# EAGLE design SulaMatikV2 (EAGLE 6.4)
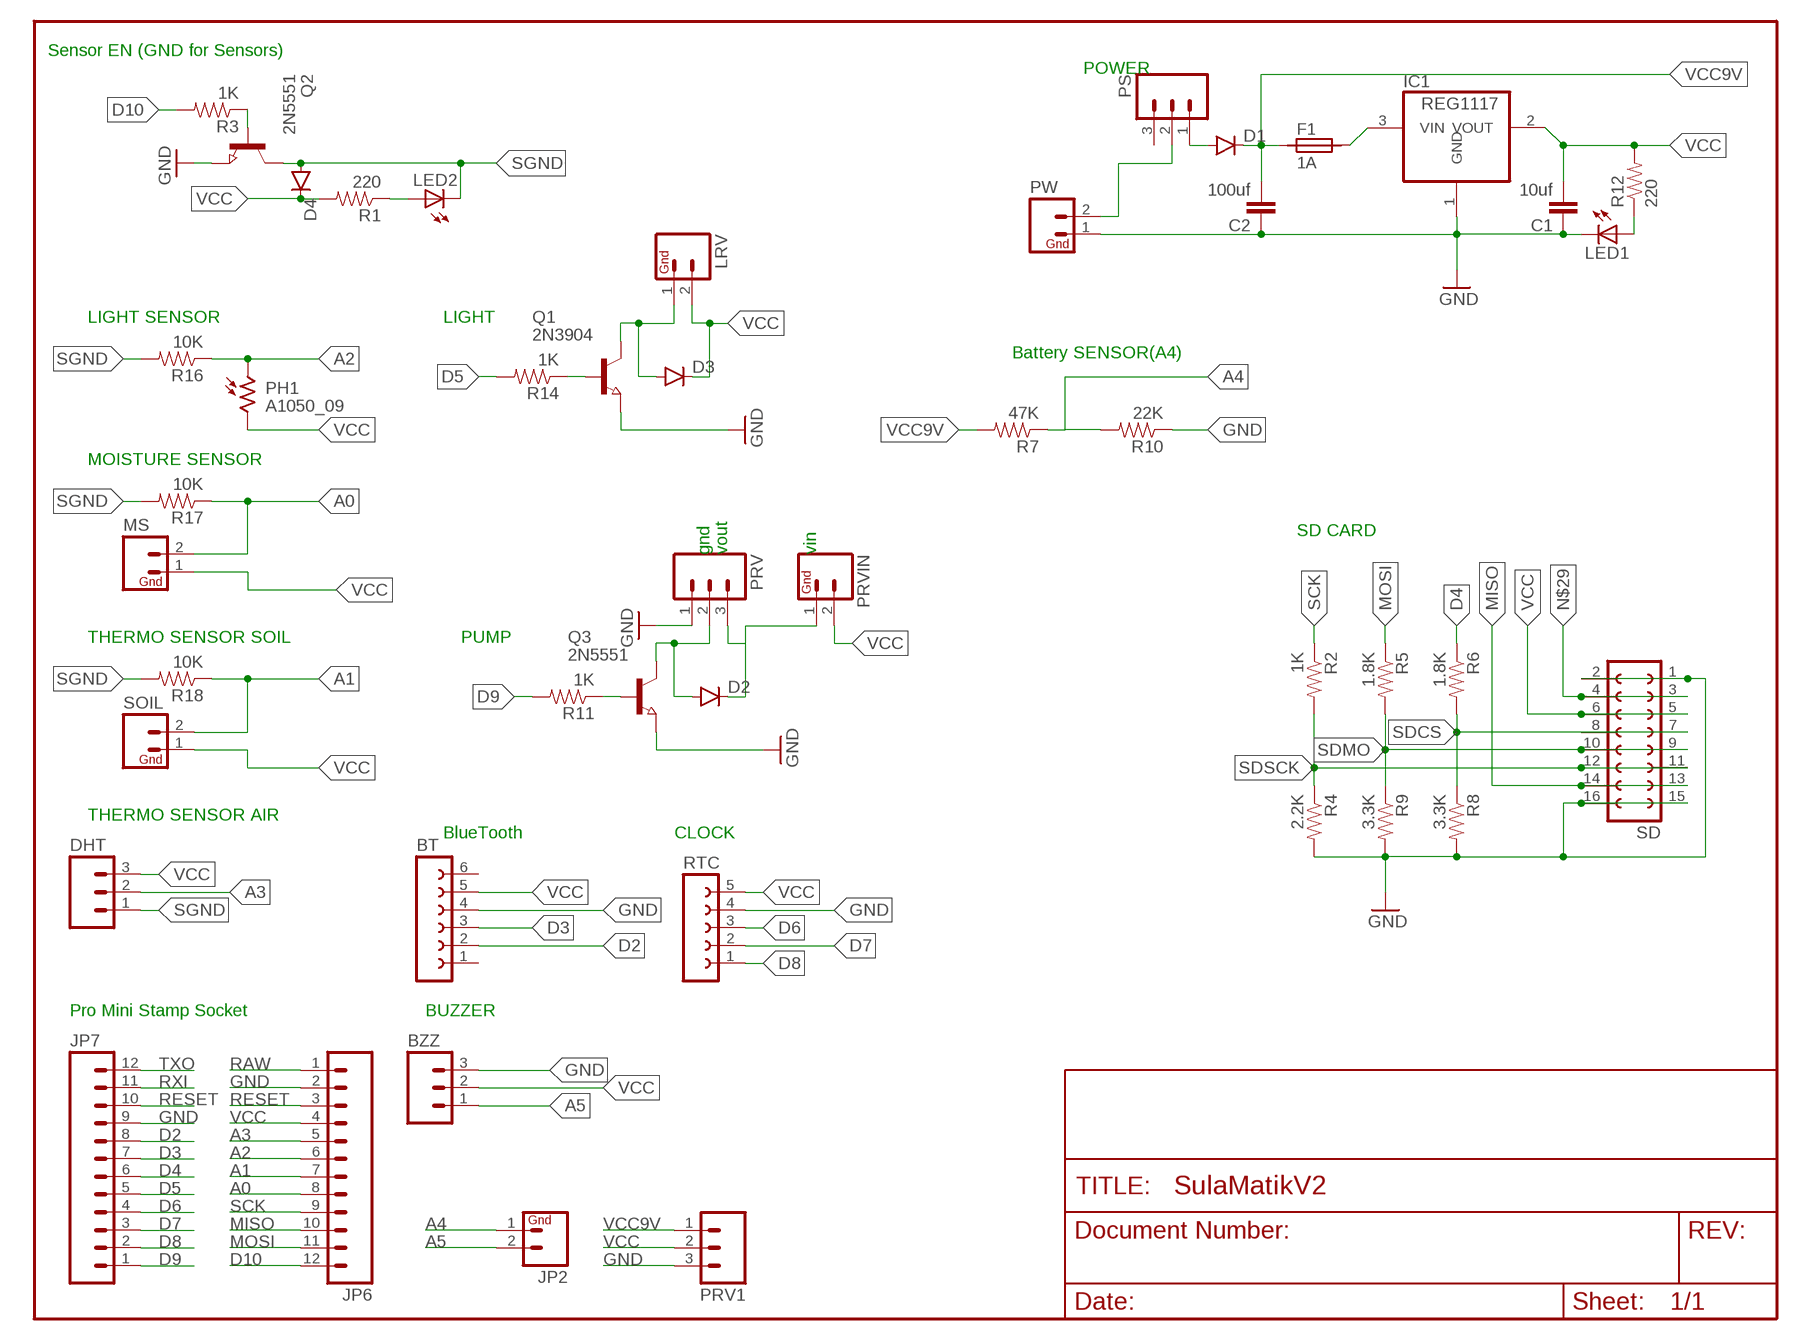
[diagram p0: schematic, sheet 1]

## Parts
BT  FE06-1  [FE06]
BZZ  M03PTH  [1X03]
C1  10uf  CAP0805  [0805]
C2  100uf  CAP0805  [0805]
D1  DIODESMA  [SMA-DIODE]
D2  DIODESMA  [SMA-DIODE]
D3  DIODESMA  [SMA-DIODE]
D4  DIODESMA  [SMA-DIODE]
DHT  M03PTH  [1X03]
F1  1A  SIBA194600  [1820]
IC1  REG1117  [SOT223]
JP2  M02PTH  [1X02]
JP6  M12PTH  [1X12]
JP7  M12PTH  [1X12]
LED1  LEDCHIP-LED0805  [CHIP-LED0805]
LED2  LEDCHIP-LED0805  [CHIP-LED0805]
LRV  M02PTH  [1X02]
MS  M02PTH  [1X02]
PH1  A1050_09  [T0-46-A10XX]
PRV  M03PTH  [1X03]
PRV1  M03PTH  [1X03]
PRVIN  M02PTH  [1X02]
PS  M03PTH  [1X03]
PW  M02PTH  [1X02]
Q1  2N3904  NPN-TRANSISTOR_SOT23  [SOT23]
Q2  2N5551  NPN-TRANSISTOR_SOT23  [SOT23]
Q3  2N5551  NPN-TRANSISTOR_SOT23  [SOT23]
R1  220  RESISTOR0805-RES  [0805]
R2  1K  RESISTOR0805-RES  [0805]
R3  1K  RESISTOR0805-RES  [0805]
R4  2.2K  RESISTOR0805-RES  [0805]
R5  1.8K  RESISTOR0805-RES  [0805]
R6  1.8K  RESISTOR0805-RES  [0805]
R7  47K  RESISTOR0805-RES  [0805]
R8  3.3K  RESISTOR0805-RES  [0805]
R9  3.3K  RESISTOR0805-RES  [0805]
R10  22K  RESISTOR0805-RES  [0805]
R11  1K  RESISTOR0805-RES  [0805]
R12  220  RESISTOR0805-RES  [0805]
R14  1K  RESISTOR0805-RES  [0805]
R16  10K  RESISTOR0805-RES  [0805]
R17  10K  RESISTOR0805-RES  [0805]
R18  10K  RESISTOR0805-RES  [0805]
RTC  FE05-1  [FE05-1]
SD  FE08-2  [FE08-2]
SOIL  M02PTH  [1X02]

## Nets
A0: JP6.8 MS.2 R17.1
A1: JP6.7 R18.1 SOIL.2
A2: JP6.6 PH1.1 R16.1
A3: DHT.2 JP6.5
A4: JP2.1 R7.1 R10.2
A5: BZZ.1 JP2.2
D2: BT.2 JP7.8
D3: BT.3 JP7.7
D4: JP7.6 R6.1
D5: JP7.5 R14.2
D6: JP7.4 RTC.3
D7: JP7.3 RTC.2
D8: JP7.2 RTC.1
D9: JP7.1 R11.2
D10: JP6.12 R3.2
GND: BT.4 BZZ.3 C1.1 C2.1 IC1.1(GND) JP6.2 JP7.9 LED1.C PRV1.3 PRV.1 PW.1 Q1.2(E) Q2.2(E) Q3.2(E) R4.2 R8.2 R9.2 R10.1 RTC.4 SD.1 SD.2 SD.15 SD.16
MISO: JP6.10 SD.13 SD.14
MOSI: JP6.11 R5.1
N$1: F1.2 IC1.3(VIN)
N$2: PS.2 PW.2
N$3: D2.C PRV.3 PRVIN.1
N$5: D2.A PRV.2 Q3.3(C)
N$6: Q3.1(B) R11.1
N$7: Q2.1(B) R3.1
N$11: LED1.A R12.1
N$13: D1.A PS.1
N$19: D3.A LRV.1 Q1.3(C)
N$20: Q1.1(B) R14.1
N$22: LED2.A R1.1
N$29: SD.3 SD.4
RAW [v]: JP6.1
RESET: JP6.3 JP7.10
RXI: JP7.11
SCK: JP6.9 R2.1
SDCS: R6.2 R8.1 SD.7 SD.8
SDMO: R5.2 R9.1 SD.9 SD.10
SDSCK: R2.2 R4.1 SD.11 SD.12
SGND: D4.A DHT.1 LED2.C Q2.3(C) R16.2 R17.2 R18.2
TXO: JP7.12
VCC: BT.5 BZZ.2 C1.2 D3.C D4.C DHT.3 IC1.2(VOUT) JP6.4 LRV.2 MS.1 PH1.2 PRV1.2 PRVIN.2 R1.2 R12.2 RTC.5 SD.5 SD.6 SOIL.1
VCC9V: C2.2 D1.C F1.1 PRV1.1 R7.2
Unconnected: BT.1 BT.6 PS.3

## Notes on the sheet
- Sensor EN (GND for Sensors)
- POWER
- LIGHT SENSOR | LIGHT
- Battery SENSOR(A4)
- MOISTURE SENSOR
- SD CARD
- gnd | vout | vin
- THERMO SENSOR SOIL | PUMP
- THERMO SENSOR AIR
- BlueTooth | CLOCK
- Pro Mini Stamp Socket | BUZZER

## Library data of the parts
BT = con-lsta:FE06-1: FEMALE HEADER; OC_FARNELL: unknown; OC_NEWARK: unknown
BZZ DHT PRV PRV1 PS = SparkFun-Connectors:M03: Header 3 Standard 3-pin 0.1" header. Use with straight break away headers (SKU : PRT-00116), right angle break away headers (PRT-00553), swiss pins (PRT-00743), machine pins (PRT-00117), and female headers (PRT-00115). Molex polarized connector foot print use with SKU : PRT-08232 with associated crimp pins and housings.
C1 C2 = SparkFun-Capacitors:CAP: Capacitor Standard 0603 ceramic capacitor, and 0.1" leaded capacitor.
D1-D4 = SparkFun-DiscreteSemi:DIODE: Diode These are standard reverse protection diodes and small signal diodes. SMA package can handle up to about 1A. SOD-323 can handle about 200mA. What the SOD-323 package when ordering, there are some mfgs out there that are 5-pin packages.
F1 = _hhn_PtcFuses_Siba_r500_Ozan:SIBA194600*: SIBA PTC-Fuses, Series 194600, 1812 (4.5 3.2)mm Source: www.siba.de/ Package: SMD 1812 (4.5 x 3.2)mm Technologies: SIBA194600Axxx xxx: Trip-Current * 10 mA Author: Dipl.-Ing. FH Rainer Bayer
IC1 = burr-brown:REG1117: 800mA and 1A Low Dropout (LDO) Positive Regulator 1.8V, 2.5V, 2.85V, 3.3V, 5V, and Adj; MPN: REG1117; OC_FARNELL: 1097566; OC_NEWARK: 14P6981
JP2 LRV MS PRVIN PW SOIL = SparkFun:M02: Header 2 Standard 2-pin 0.1" header. Use with straight break away headers (SKU : PRT-00116), right angle break away headers (PRT-00553), swiss pins (PRT-00743), machine pins (PRT-00117), and female headers (PRT-00115). Molex polarized connector foot print use with SKU : PRT-08233 with associated crimp pins and housings.
JP6 JP7 = SparkFun:M12: Header 12 Standard 12-pin 0.1" header. Use with straight break away headers (SKU : PRT-00116), right angle break away headers (PRT-00553), swiss pins (PRT-00743), machine pins (PRT-00117), and female headers (PRT-00115).
LED1 LED2 = led:LED: LED OSRAM: - CHIPLED LG R971, LG N971, LY N971, LG Q971, LY Q971, LO R971, LY R971 LH N974, LH R974 LS Q976, LO Q976, LY Q976 LO Q996 - Hyper CHIPLED LW Q18S LB Q993, LB Q99A, LB R99A - SideLED LS A670, LO A670, LY A670, LG A670, LP A670 LB A673, LV A673, LT A673, LW A673 LH A674 LY A675 LS A676, LA A676, LO A676, LY A676, LW A676 LS A679, LY A679, LG A679 - Hyper Micro SIDELED® LS Y876, LA Y876, LO Y876, LY Y876 LT Y87S - SmartLED LW L88C, LW L88S LB L89C, LB L89S, LG L890 LS L89K, LO L89K, LY L89K LS L896, LA L896, LO L896, LY L896 - TOPLED LS T670, LO T670, LY T670, LG T670, LP T670 LSG T670, LSP T670, LSY T670, LOP T670, LYG T670 LG T671, LOG T671, LSG T671 LB T673, LV T673, LT T673, LW T673 LH T674 LS T676, LA T676, LO T676, LY T676, LB T676, LH T676, LSB T676, LW T676 LB T67C, LV T67C, LT T67C, LS T67K, LO T67K, LY T67K, LW E67C LS E67B, LA E67B, LO E67B, LY E67B, LB E67C, LV E67C, LT E67C LW T67C LS T679, LY T679, LG T679 LS T770, LO T770, LY T770, LG T770, LP T770 LB T773, LV T773, LT T773, LW T773 LH T774 LS E675, LA E675, LY E675, LS T675 LS T776, LA T776, LO T776, LY T776, LB T776 LHGB T686 LT T68C, LB T68C - Hyper Mini TOPLED® LB M676 - Mini TOPLED Santana® LG M470 LS M47K, LO M47K, LY M47K Source: http://www.osram.convergy.de LUXEON: - LUMILED® LXK2-PW12-R00, LXK2-PW12-S00, LXK2-PW14-U00, LXK2-PW14-V00 LXK2-PM12-R00, LXK2-PM12-S00, LXK2-PM14-U00 LXK2-PE12-Q00, LXK2-PE12-R00, LXK2-PE12-S00, LXK2-PE14-T00, LXK2-PE14-U00 LXK2-PB12-K00, LXK2-PB12-L00, LXK2-PB12-M00, LXK2-PB14-N00, LXK2-PB14-P00, LXK2-PB14-Q00 LXK2-PR12-L00, LXK2-PR12-M00, LXK2-PR14-Q00, LXK2-PR14-R00 LXK2-PD12-Q00, LXK2-PD12-R00, LXK2-PD12-S00 LXK2-PH12-R00, LXK2-PH12-S00 LXK2-PL12-P00, LXK2-PL12-Q00, LXK2-PL12-R00 Source: www.luxeon.com KINGBRIGHT: KA-3528ASYC Source: www.kingbright.com
PH1 = photo-elements:A10: Sensor Robust Light Sensing Applications Outdoor Light Sensing Application Source: http://optoelectronics.perkinelmer.com/content/Datasheets/DTS_PhotocellsA1050.pdf
Q1-Q3 = semicon-smd-ipc:NPN-TRANSISTOR_: NPN TRANSISTOR
R1-R12 R14 R16-R18 = SparkFun-Passives:RESISTOR: Resistor Basic schematic elements and footprints for 0603, 1206, and PTH resistors.
RTC = con-lsta:FE05-1: FEMALE HEADER; OC_FARNELL: unknown; OC_NEWARK: unknown
SD = con-lsta:FE08-2: FEMALE HEADER; OC_FARNELL: unknown; OC_NEWARK: unknown

## Net classes
0 default: width 0.3 mm, drill 0.5 mm, clearance 0.25 mm

## Board
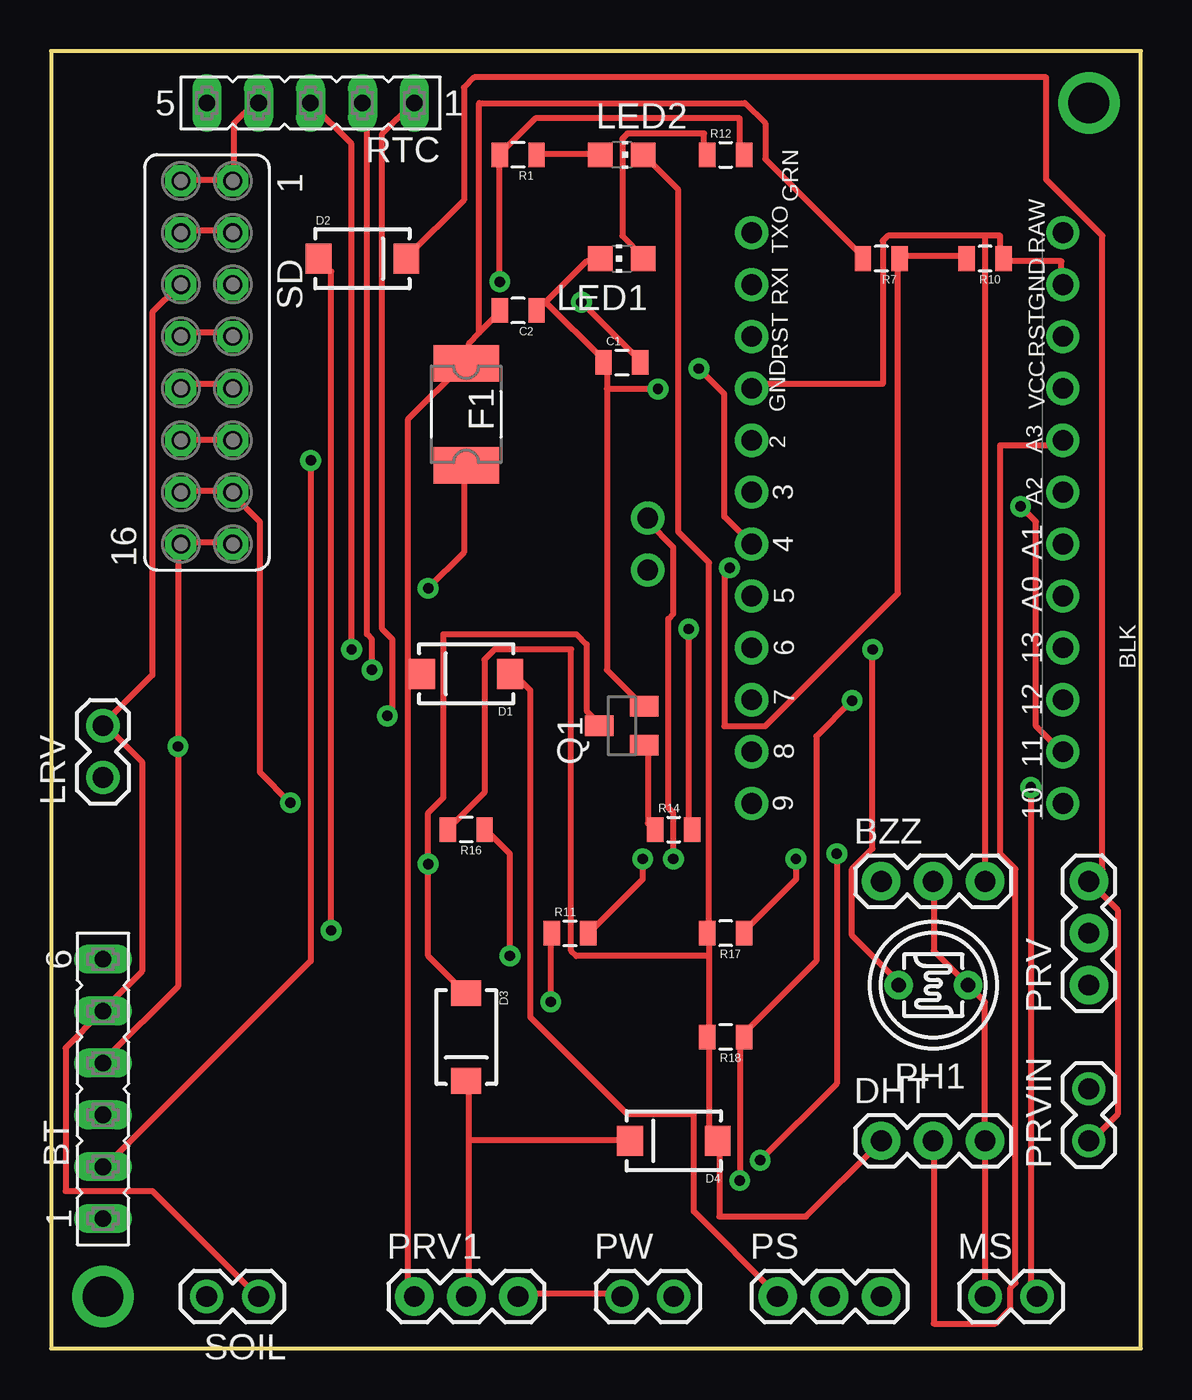
[diagram p1: board, top side]
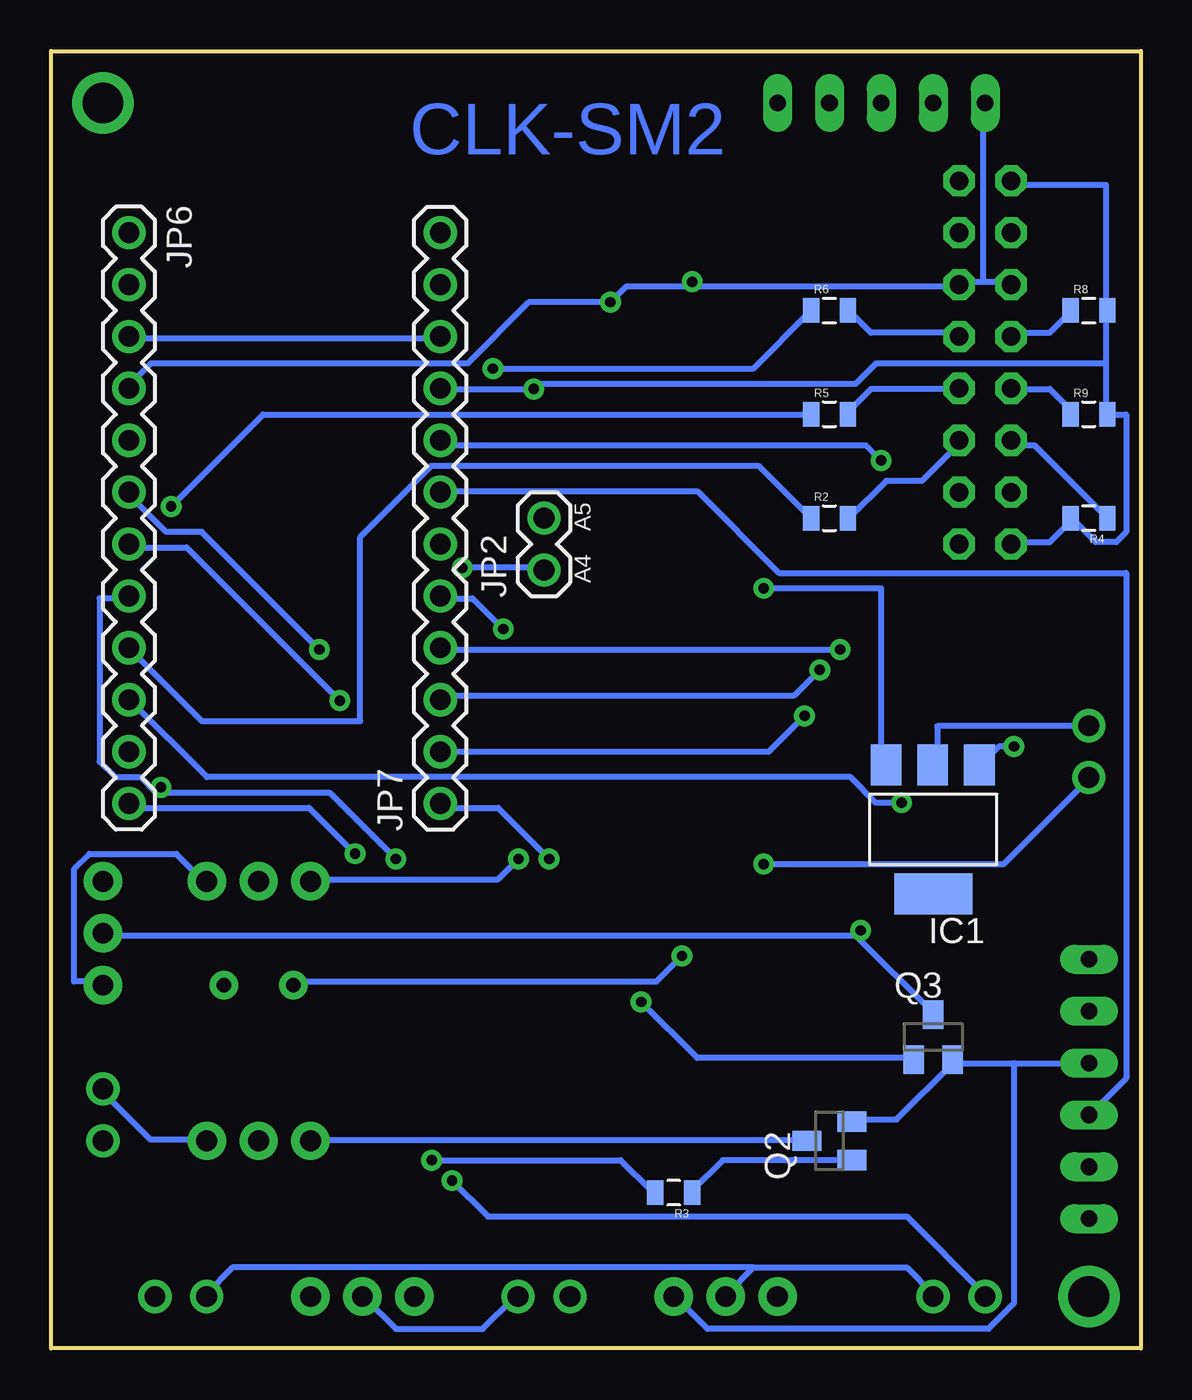
[diagram p2: board, bottom side, seen from below]

Size 53.34 x 63.5 mm. Coordinates in mm from the lower left corner, seen from the top.
Outline: 0,63.5 0,0 53.34,0 53.34,63.5 0,63.5
Copper layers (1*16): Top 0.035mm / dielectric 1.5mm / Bottom 0.035mm
Design rules "SparkFun *": minimum track width 8mil, minimum drill 20mil, track to track 8mil, track to pad 8mil, pad to pad 8mil, via to via 8mil, smd to smd 8mil, copper to edge 10mil, drill to drill 8mil, minimum pad ring 12mil, minimum via ring 10mil, stop-mask expansion 4mil, vias tented up to drill 20mil, thermal gap 10mil

### Footprints (pad centres in the part's own frame; a part is rotated, then mirrored left to right if it is on the bottom)
FE06 = drill 0.813 long: 1 -6.35,0; 2 -3.81,0; 3 -1.27,0; 4 1.27,0; 5 3.81,0; 6 6.35,0
1X03 = drill 1.016 pad 1.88: 1 0,0; 2 2.54,0; 3 5.08,0
0805 = smd 0.8 x 1.2: 1 -0.9,0; 2 0.9,0
SMA-DIODE = smd 1.27 x 1.47: A -2.15,0; C 2.15,0
1820 = smd 1.78 x 3.2: 1 -2.49,0; 2 2.49,0
SOT223 = smd 1.499 x 2.007: 1 -2.261,-3.15; 2 0.025,-3.15; 3 2.311,-3.15 | smd 3.81 x 2.007: 4 0,3.15
1X02 = drill 1.016: 1 0,0; 2 2.54,0
1X12 = drill 1.016: 1 0,0; 2 2.54,0; 3 5.08,0; 4 7.62,0; 5 10.16,0; 6 12.7,0; 7 15.24,0; 8 17.78,0; 9 20.32,0; 10 22.86,0; 11 25.4,0; 12 27.94,0
CHIP-LED0805 = smd 1.2 x 1.2: A 0,-1.05; C 0,1.05
T0-46-A10XX = drill 0.7 pad 1.4: 1 -1.7,0; 2 1.7,0
SOT23 = smd 1 x 1.4: 1 -0.95,-1.1; 2 0.95,-1.1; 3 0,1.1
FE05-1 = drill 0.813 long: 1 -5.08,0; 2 -2.54,0; 3 0,0; 4 2.54,0; 5 5.08,0
FE08-2 = drill 0.914 octagon: 1 -8.89,1.27; 2 -8.89,-1.27; 3 -6.35,1.27; 4 -6.35,-1.27; 5 -3.81,1.27; 6 -3.81,-1.27; 7 -1.27,1.27; 8 -1.27,-1.27; 9 1.27,1.27; 10 1.27,-1.27; 11 3.81,1.27; 12 3.81,-1.27; 13 6.35,1.27; 14 6.35,-1.27; 15 8.89,1.27; 16 8.89,-1.27

### Placement (x,y rotation side)
BT  2.54,12.7 90 top
BZZ  40.64,22.86 0 top
C1  27.94,48.26 0 top
C2  22.86,50.8 180 top
D1  20.32,33.02 180 top
D2  15.24,53.34 0 top
D3  20.32,15.24 270 top
D4  30.48,10.16 180 top
DHT  40.64,10.16 0 top
F1  20.32,45.72 270 top
IC1  10.16,25.4 180 bottom
JP2  29.21,38.1 90 bottom
JP6  49.53,54.61 270 bottom
JP7  34.29,26.67 90 bottom
LED1  27.94,53.34 90 top
LED2  27.94,58.42 270 top
LRV  2.54,27.94 90 top
MS  45.72,2.54 0 top
PH1  43.18,17.78 0 top
PRV  50.8,17.78 90 top
PRV1  17.78,2.54 0 top
PRVIN  50.8,10.16 90 top
PS  35.56,2.54 0 top
PW  27.94,2.54 0 top
Q1  27.94,30.48 90 top
Q2  15.24,10.16 90 bottom
Q3  10.16,15.24 0 bottom
R1  22.86,58.42 180 top
R2  15.24,40.64 0 bottom
R3  22.86,7.62 180 bottom
R4  2.54,40.64 180 bottom
R5  15.24,45.72 0 bottom
R6  15.24,50.8 0 bottom
R7  40.64,53.34 180 top
R8  2.54,50.8 0 bottom
R9  2.54,45.72 0 bottom
R10  45.72,53.34 180 top
R11  25.4,20.32 0 top
R12  33.02,58.42 0 top
R14  30.48,25.4 0 top
R16  20.32,25.4 180 top
R17  33.02,20.32 180 top
R18  33.02,15.24 180 top
RTC  12.7,60.96 180 top
SD  7.62,48.26 270 top
SOIL  10.16,2.54 180 top

### Tracks (layer width: path | path; a pad name or v marks a point on that pad's centre or on a via)
A0  (via drill 0.51)
  Top 0.3: v36.46,23.96 36.46,22.96 33.96,20.46 R17.1 | v47.96,27.46 47.96,2.96 48.21,2.71 MS.2
  Bottom 0.3: v36.46,23.96 39.71,27.21 47.96,27.21 | 47.96,27.21 48.21,27.21 48.96,27.96 50.21,27.96 50.96,28.71 50.96,36.71 49.71,36.71 JP6.8 | 47.96,27.21 v47.96,27.46
A1  (via drill 0.51)
  Top 0.3: v39.21,31.71 37.46,29.96 37.46,18.96 33.96,15.46 R18.1 33.71,15.21 v33.71,8.21
  Bottom 0.3: v39.21,31.71 46.71,39.21 49.46,39.21 JP6.7 | v33.71,8.21 31.96,6.46 11.46,6.46 7.71,2.71 SOIL.2
A2  (via drill 0.51)
  Top 0.3: v22.46,19.21 22.46,24.21 21.46,25.21 R16.1 | v40.21,34.21 40.21,24.46 39.21,23.46 39.21,20.21 41.46,17.96 PH1.1
  Bottom 0.3: v22.46,19.21 23.71,17.96 41.46,17.96 PH1.1 | v40.21,34.21 45.96,39.96 47.71,39.96 49.46,41.71 JP6.6
A3
  Top 0.3: JP6.5 49.46,44.21 46.46,44.21 46.46,24.21 47.21,23.46 47.21,3.21 46.96,2.96 46.96,1.96 46.21,1.21 43.21,1.21 43.21,9.96 DHT.2
A4  (via drill 0.51)
  Top 0.3: R10.2 44.71,53.46 41.71,53.46 R7.1 41.46,53.21 41.46,36.96 34.96,30.46 32.96,30.46 32.96,37.96 v33.21,38.21
  Bottom 0.3: v33.21,38.21 29.21,38.21 JP2.1
A5  (via drill 0.51)
  Top 0.3: v30.46,23.96 30.46,26.21 30.21,26.46 30.21,35.71 30.46,35.96 30.46,39.21 29.21,40.46 JP2.2
  Bottom 0.3: v30.46,23.96 31.46,22.96 40.46,22.96 BZZ.1
D2  (via drill 0.51)
  Top 0.3: v12.71,43.46 12.71,18.96 2.71,8.96 BT.2
  Bottom 0.3: v12.71,43.46 13.46,44.21 34.21,44.21 JP7.8
D3
  Bottom 0.3: BT.3 2.46,11.46 0.71,13.21 0.71,37.96 17.71,37.96 21.71,41.96 34.21,41.96 JP7.7
D4  (via drill 0.51)
  Top 0.3: v31.71,47.96 32.96,46.71 32.96,40.71 34.21,39.46 JP7.6
  Bottom 0.3: v31.71,47.96 18.96,47.96 16.21,50.71 R6.1
D5  (via drill 0.51)
  Top 0.3: v31.21,35.21 31.21,25.46 R14.2
  Bottom 0.3: v31.21,35.21 32.71,36.71 34.21,36.71 JP7.5
D6  (via drill 0.51)
  Top 0.3: v14.71,34.21 14.71,58.96 RTC.3
  Bottom 0.3: v14.71,34.21 34.21,34.21 JP7.4
D7  (via drill 0.51)
  Top 0.3: v15.71,33.21 15.71,34.71 15.46,34.96 15.46,60.96 RTC.2
  Bottom 0.3: v15.71,33.21 16.96,31.96 34.21,31.96 JP7.3
D8  (via drill 0.51)
  Top 0.3: v16.46,30.96 16.71,31.21 16.71,34.71 16.21,35.21 16.21,59.46 17.71,60.96 RTC.1
  Bottom 0.3: v16.46,30.96 18.21,29.21 JP7.2
D9  (via drill 0.51)
  Top 0.3: v28.96,23.96 28.96,22.96 26.46,20.46 R11.2
  Bottom 0.3: v28.96,23.96 31.46,26.46 34.21,26.46 JP7.1
D10  (via drill 0.51)
  Top 0.3: v34.71,9.21 38.46,12.96 v38.46,24.21
  Bottom 0.3: v34.71,9.21 25.46,9.21 23.96,7.71 R3.2 | v38.46,24.21 40.71,26.46 49.46,26.46 JP6.12
GND  (via drill 0.51)
  Top 0.3: 24.21,51.21 26.21,53.21 26.71,53.21 LED1.C | 24.21,51.21 23.96,50.96 C2.1 | 24.21,51.21 26.96,48.46 C1.1 27.21,48.21 27.21,46.96 | 27.21,46.96 27.21,33.21 28.96,31.46 Q1.2 | JP6.2 49.46,52.21 49.46,53.21 46.71,53.21 R10.1 46.46,53.46 46.46,54.46 45.71,54.46 | 45.71,54.46 40.96,54.46 40.71,54.21 40.71,47.21 34.46,47.21 JP7.9 | 45.71,54.46 45.71,22.96 BZZ.3 | v29.71,46.96 27.21,46.96 | PW.1 27.71,2.71 22.96,2.71 PRV1.3 | SD.15 8.71,39.46 6.46,39.46 SD.16 6.21,39.21 v6.21,29.46 6.21,17.71 2.71,14.21 BT.4 | RTC.4 9.96,60.96 8.96,59.96 8.96,57.21 SD.1 8.71,57.21 6.46,57.21 SD.2
  Bottom 0.3: BZZ.3 45.96,22.96 47.21,24.21 51.46,24.21 52.21,23.46 52.21,17.96 50.96,17.96 PRV.1 | JP7.9 34.21,46.96 v29.71,46.96 29.46,47.21 13.96,47.21 12.96,48.21 1.71,48.21 | 9.21,13.96 11.96,11.21 13.96,11.21 Q2.2 | 9.21,13.96 6.21,13.96 | 6.21,13.96 2.71,13.96 BT.4 | 9.21,13.96 Q3.2 | 6.21,13.96 6.21,2.21 7.46,0.96 21.21,0.96 22.71,2.46 PRV1.3 | 7.96,28.71 IC1.1 7.71,28.71 6.96,29.46 v6.21,29.46 | SD.16 6.21,39.46 4.46,39.46 3.46,40.46 R4.2 3.21,40.46 2.21,39.46 1.21,39.46 0.71,39.96 0.71,45.71 1.46,45.71 R9.2 1.71,45.96 1.71,48.21 | 1.71,48.21 1.71,50.71 R8.2 1.71,50.96 1.71,56.96 6.21,56.96 SD.2
MISO  (via drill 0.51)
  Top 0.3: SD.14 6.46,41.96 8.71,41.96 SD.13 8.96,41.71 10.21,40.46 10.21,28.21 v11.71,26.71
  Bottom 0.3: v11.71,26.71 12.96,26.71 14.21,27.96 45.71,27.96 49.46,31.71 JP6.10
MOSI  (via drill 0.51)
  Top 0.3: v47.46,41.21 48.21,40.46 48.21,30.46 49.46,29.21 JP6.11
  Bottom 0.3: v47.46,41.21 42.96,45.71 16.21,45.71 R5.1
N$1  (via drill 0.51)
  Top 0.3: v18.46,37.21 20.21,38.96 20.21,43.21 F1.2
  Bottom 0.3: v18.46,37.21 12.71,37.21 12.71,28.71 IC1.3
N$2
  Bottom 0.3: PW.2 30.71,2.46 32.21,0.96 36.46,0.96 37.96,2.46 PS.2
N$3
  Top 0.3: D2.C 17.46,53.46 20.21,56.21 20.21,61.71 20.71,62.21 48.71,62.21 48.71,57.21 51.46,54.46 51.46,23.46 50.96,22.96 PRV.3 50.96,22.71 52.21,21.46 52.21,11.46 50.96,10.21 PRVIN.1
N$4  (via drill 2)
  other vias: 2.54,2.54
N$5  (via drill 0.51)
  Top 0.3: v13.71,20.46 13.71,52.71 13.21,53.21 D2.A
  Bottom 0.3: 13.96,20.21 10.21,16.46 Q3.3 | 13.96,20.21 50.71,20.21 PRV.2 | 13.96,20.21 v13.71,20.46
N$6  (via drill 0.51)
  Top 0.3: v24.46,16.96 24.46,20.21 R11.1
  Bottom 0.3: v24.46,16.96 21.71,14.21 11.21,14.21 Q3.1
N$7
  Bottom 0.3: Q2.1 20.46,9.21 21.96,7.71 R3.1
N$9  (via drill 2)
  other vias: 50.8,60.96
N$11
  Top 0.3: LED1.A 28.96,53.46 27.96,54.46 27.96,59.21 28.21,59.46 31.96,59.46 31.96,58.46 R12.1
N$13
  Top 0.3: D1.A 22.71,32.96 23.46,32.21 23.46,16.21 28.21,11.46 31.46,11.46 31.46,6.71 35.46,2.71 PS.1
N$19  (via drill 0.51)
  Top 0.3: Q1.3 26.71,30.71 26.21,31.21 26.21,34.46 25.71,34.96 19.21,34.96 19.21,26.96 18.46,26.21 v18.46,23.71 18.46,19.21 20.21,17.46 D3.A
  Bottom 0.3: v18.46,23.71 6.71,23.71 2.71,27.71 LRV.1
N$20
  Top 0.3: R14.1 29.46,25.46 29.21,25.71 29.21,29.46 Q1.1
N$22
  Top 0.3: R1.1 23.96,58.46 26.71,58.46 LED2.A
N$29
  Top 0.3: SD.4 6.46,54.71 8.71,54.71 SD.3
RESET
  Bottom 0.3: JP7.10 34.46,49.46 49.46,49.46 JP6.3
SCK
  Bottom 0.3: R2.1 18.71,43.21 34.71,43.21 38.21,39.71 38.21,30.71 45.96,30.71 49.46,34.21 JP6.9
SDCS
  Top 0.3: SD.8 6.46,49.71 8.71,49.71 SD.7
  Bottom 0.3: R8.1 3.46,50.71 4.46,49.71 6.21,49.71 SD.8 | R6.2 14.21,50.71 13.21,49.71 8.96,49.71 SD.7
SDMO
  Top 0.3: SD.10 6.46,47.21 8.71,47.21 SD.9
  Bottom 0.3: R9.1 3.46,45.96 4.46,46.96 6.21,46.96 SD.10 | R5.2 14.21,45.96 13.21,46.96 8.96,46.96 SD.9
SDSCK
  Top 0.3: SD.12 6.46,44.46 8.71,44.46 SD.11
  Bottom 0.3: R4.1 5.21,44.21 6.21,44.21 SD.12 | R2.2 14.21,40.71 12.46,42.46 10.71,42.46 8.96,44.21 SD.11
SGND
  Top 0.3: 32.21,19.21 32.21,20.21 R17.2 32.21,20.46 32.21,38.46 30.71,39.96 30.71,56.71 29.21,58.21 LED2.C | 32.21,19.21 32.21,15.46 R18.2 32.21,15.21 32.21,10.46 32.46,10.21 D4.A 32.71,9.96 32.71,6.46 36.96,6.46 40.46,9.96 DHT.1 | 32.21,19.21 25.71,19.21 25.46,19.46 25.46,34.21 21.71,34.21 21.21,33.71 21.21,27.21 19.46,25.46 R16.2
  Bottom 0.3: Q2.3 16.46,10.21 40.46,10.21 DHT.1
VCC  (via drill 0.51)
  Top 0.3: BZZ.2 43.21,22.71 43.21,19.46 44.71,17.96 PH1.2 44.96,17.71 45.71,16.96 45.71,10.21 DHT.3 45.71,9.96 45.71,2.71 MS.1 | 20.46,10.21 20.46,2.71 PRV1.2 | 20.46,10.21 20.46,12.96 D3.C | 20.46,10.21 28.21,10.21 D4.C | R12.2 33.71,58.46 33.71,60.21 23.71,60.21 21.96,58.46 R1.2 v21.96,52.21 | v25.96,51.21 28.71,48.46 C1.2 | SD.6 6.21,51.96 4.96,50.71 4.96,32.96 2.71,30.71 LRV.2 2.71,30.46 4.46,28.71 4.46,18.46 2.71,16.71 BT.5 2.46,16.46 0.71,14.71 0.71,7.71 4.96,7.71 9.96,2.71 SOIL.1
  Bottom 0.3: PRVIN.2 50.71,12.46 48.46,10.21 45.96,10.21 DHT.3 | 18.96,3.96 11.46,3.96 10.21,2.71 SOIL.1 | 18.96,3.96 20.21,2.71 PRV1.2 | IC1.2 9.96,28.71 9.96,30.46 2.71,30.46 LRV.2 | 21.96,51.96 8.96,51.96 SD.5 8.71,52.21 7.71,52.21 | 21.96,51.96 25.21,51.96 v25.96,51.21 29.96,51.21 32.96,48.21 48.46,48.21 49.46,47.21 JP6.4 | 7.71,52.21 7.71,60.96 RTC.5 | 7.71,52.21 6.46,52.21 SD.6 | 21.96,51.96 v21.96,52.21 | 18.96,3.96 44.46,3.96 45.71,2.71 MS.1
VCC9V
  Top 0.3: 20.96,49.71 20.46,49.21 20.46,48.21 F1.1 20.21,48.21 17.46,45.46 17.46,33.71 | 20.96,49.71 21.96,50.71 C2.2 | 20.96,49.71 20.96,60.96 33.96,60.96 34.96,59.96 34.96,58.21 39.71,53.46 R7.2 | 17.46,33.71 17.96,33.21 D1.C | 17.46,33.71 17.46,2.96 17.71,2.71 PRV1.1

### Text on the board
Bottom: CLK-SM2
tPlace: GRN | TXO | RAW | RXI | GND | RST | RST | VCC | GND | 2 | A3 | 3 | A2 | 4 | A1 | 5 | A0 | 6 | 13 | BLK | 7 | 12 | 8 | 11 | 9 | 10
bPlace: A5 | A4